# EAGLE schematic RadioNetwork (EAGLE 6.6.0)
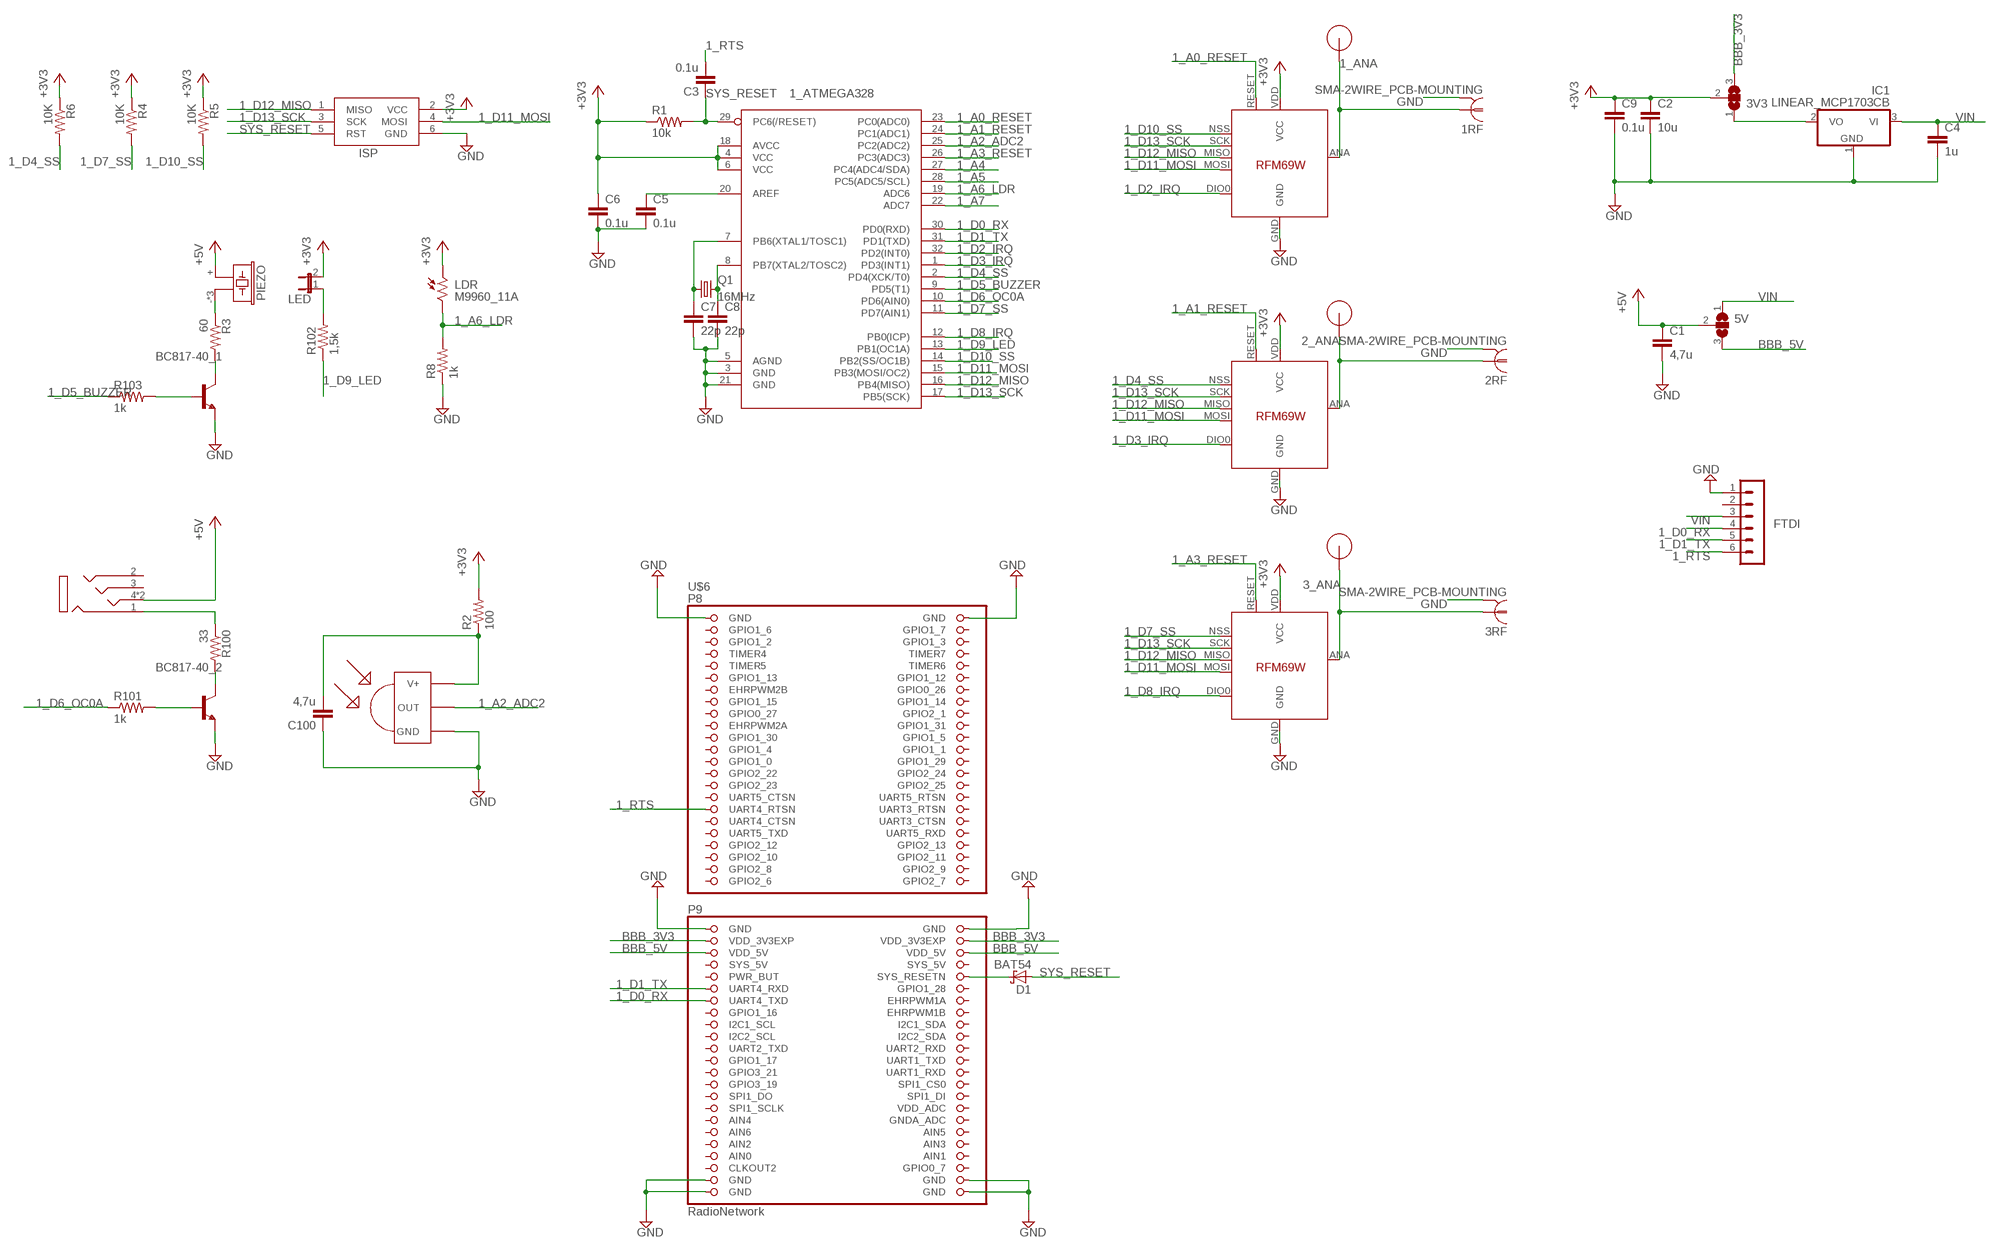
[diagram p0: schematic, sheet 1]

## Parts
1_ATMEGA328  ATMega-328  ATMEGA168/328TQFP32  [TQFP32-08]
1_RFM69  RFM69_MINIPADS  [RFM69W-MINPADS]
1RF  SMA-2WIRE_PCB-MOUNTING  [J01151A0931]
2_RFM69  RFM69_MINIPADS  [RFM69W-MINPADS]
2RF  SMA-2WIRE_PCB-MOUNTING  [J01151A0931]
3_RFM69  RFM69_MINIPADS  [RFM69W-MINPADS]
3RF  SMA-2WIRE_PCB-MOUNTING  [J01151A0931]
3V3  SJ2W  [SJ_2]
5V  SJ2W  [SJ_2]
BC817-40_1  BC817-40-NPN-SOT23-BEC  [SOT23-BEC]
BC817-40_2  BC817-40-NPN-SOT23-BEC  [SOT23-BEC]
C1  4,7u  CAP0603-CAP  [0603-CAP]
C2  10u  CAP0603-CAP  [0603-CAP]
C3  0.1u  CAP0603-CAP  [0603-CAP]
C4  1u  CAP0603-CAP  [0603-CAP]
C5  0.1u  CAP0603-CAP  [0603-CAP]
C6  0.1u  CAP0603-CAP  [0603-CAP]
C7  22p  CAP0603-CAP  [0603-CAP]
C8  22p  CAP0603-CAP  [0603-CAP]
C9  0.1u  CAP0603-CAP  [0603-CAP]
C100  4,7u  CAP0603-CAP  [0603-CAP]
D1  BAT54  [SOT23]
FTDI  FTDI  MA06-1  [MA06-1]
IC1  LINEAR_MCP1703CB  [LINEAR_SOT23]
IR-RX  TSOP4836  [TSOP18XX]
IR-TX  1503_13  [1503-03]
ISP  AVRISP-6  [AVRISP]
LDR  M9960_11A  [M9960]
LED  JP1E  [JP1]
PIEZO  BUZZER-PIEZO_SMD  [BUZZER-PIEZO_SMD]
Q1  16MHz  CRYSTALHC49S  [HC49/S]
R1  10k  RESISTOR0603-RES  [0603-RES]
R2  100  RESISTOR0603-RES  [0603-RES]
R3  60  RESISTOR0603-RES  [0603-RES]
R4  10K  RESISTOR0603-RES  [0603-RES]
R5  10K  RESISTOR0603-RES  [0603-RES]
R6  10K  RESISTOR0603-RES  [0603-RES]
R8  1k  RESISTOR0603-RES  [0603-RES]
R100  33  RESISTOR0603-RES  [0603-RES]
R101  1k  RESISTOR0603-RES  [0603-RES]
R102  1,5k  RESISTOR0603-RES  [0603-RES]
R103  1k  RESISTOR0603-RES  [0603-RES]
U$1  RFM12B_ANTENNA  [RFM12B-ANTENNA]
U$2  RFM12B_ANTENNA  [RFM12B-ANTENNA]
U$5  RFM12B_ANTENNA  [RFM12B-ANTENNA]
U$6  RadioNetwork  BEAGLEBONE_OUTLINE  [BEAGLEBONE_SHIELD]

## Nets
1_A0_RESET: 1_ATMEGA328.23(PC0(ADC0)) 1_RFM69.RESET
1_A1_RESET: 1_ATMEGA328.24(PC1(ADC1)) 2_RFM69.RESET
1_A2_ADC2: 1_ATMEGA328.25(PC2(ADC2)) IR-RX.OUT
1_A3_RESET: 1_ATMEGA328.26(PC3(ADC3)) 3_RFM69.RESET
1_A4: 1_ATMEGA328.27(PC4(ADC4/SDA))
1_A5: 1_ATMEGA328.28(PC5(ADC5/SCL))
1_A6_LDR: 1_ATMEGA328.19(ADC6) LDR.2 R8.2
1_A7: 1_ATMEGA328.22(ADC7)
1_ANA [ANT]: 1_RFM69.ANA(ANT) 1RF.1 U$1.P$1
1_AREF: 1_ATMEGA328.20(AREF) C5.1
1_D0_RX: 1_ATMEGA328.30(PD0(RXD)) FTDI.4 U$6.59(UART4_TXD)
1_D1_TX: 1_ATMEGA328.31(PD1(TXD)) FTDI.5 U$6.57(UART4_RXD)
1_D2_IRQ: 1_ATMEGA328.32(PD2(INT0)) 1_RFM69.DIO0(DIO0/IRQ)
1_D3_IRQ: 1_ATMEGA328.1(PD3(INT1)) 2_RFM69.DIO0(DIO0/IRQ)
1_D4_SS: 1_ATMEGA328.2(PD4(XCK/T0)) 2_RFM69.NSS(SEL) R6.2
1_D5_BUZZER: 1_ATMEGA328.9(PD5(T1)) R103.1
1_D6_OC0A: 1_ATMEGA328.10(PD6(AIN0)) R101.1
1_D7_SS: 1_ATMEGA328.11(PD7(AIN1)) 3_RFM69.NSS(SEL) R4.2
1_D8_IRQ: 1_ATMEGA328.12(PB0(ICP)) 3_RFM69.DIO0(DIO0/IRQ)
1_D9_LED: 1_ATMEGA328.13(PB1(OC1A)) R102.1
1_D10_SS: 1_ATMEGA328.14(PB2(SS/OC1B)) 1_RFM69.NSS(SEL) R5.2
1_D11_MOSI: 1_ATMEGA328.15(PB3(MOSI/OC2)) 1_RFM69.MOSI 2_RFM69.MOSI 3_RFM69.MOSI ISP.4(MOSI)
1_D12_MISO: 1_ATMEGA328.16(PB4(MISO)) 1_RFM69.MISO 2_RFM69.MISO 3_RFM69.MISO ISP.1(MISO)
1_D13_SCK: 1_ATMEGA328.17(PB5(SCK)) 1_RFM69.SCK 2_RFM69.SCK 3_RFM69.SCK ISP.3(SCK)
1_RTS: C3.2 FTDI.6 U$6.33(UART4_RTSN)
2_ANA [ANT]: 2_RFM69.ANA(ANT) 2RF.1 U$5.P$1
3_ANA [ANT]: 3_RFM69.ANA(ANT) 3RF.1 U$2.P$1
+3V3 [power]: 1_ATMEGA328.4(VCC) 1_ATMEGA328.6(VCC) 1_ATMEGA328.18(AVCC) 1_RFM69.VDD(VCC) 2_RFM69.VDD(VCC) 3_RFM69.VDD(VCC) 3V3.2 C2.1 C6.1 C9.1 ISP.2(VCC) LDR.1 LED.2 R1.1 R2.2 R4.1 R5.1 R6.1
+5V [power]: 5V.2 C1.1 IR-TX.4 IR-TX.4-2 PIEZO.+
BBB_3V3 [power]: 3V3.3 U$6.49(VDD_3V3EXP) U$6.50(VDD_3V3EXP)
BBB_5V [power]: 5V.3 U$6.51(VDD_5V) U$6.52(VDD_5V)
GND [power]: 1_ATMEGA328.3(GND) 1_ATMEGA328.5(AGND) 1_ATMEGA328.21(GND) 1_RFM69.GND 1RF.G@1 1RF.G@2 1RF.G@3 1RF.G@4 2_RFM69.GND 2RF.G@1 2RF.G@2 2RF.G@3 2RF.G@4 3_RFM69.GND 3RF.G@1 3RF.G@2 3RF.G@3 3RF.G@4 BC817-40_1.E BC817-40_2.E C1.2 C2.2 C4.2 C5.2 C6.2 C7.2 C8.2 C9.2 C100.1 FTDI.1 IC1.1(GND) IR-RX.GND ISP.6(GND) R8.1 U$6.1(GND) U$6.2(GND) U$6.47(GND) U$6.48(GND) U$6.89(GND) U$6.90(GND) U$6.91(GND) U$6.92(GND)
N$1: 1_ATMEGA328.7(PB6(XTAL1/TOSC1)) C7.1 Q1.1
N$2: PIEZO.- PIEZO.DUMMY PIEZO.DUMMY1 R3.1
N$3: IR-TX.1 R100.1
N$4: BC817-40_2.C R100.2
N$5: D1.3(C) U$6.56(SYS_RESETN)
N$6: 3V3.1 IC1.2(VO)
N$7: 1_ATMEGA328.8(PB7(XTAL2/TOSC2)) C8.1 Q1.2
N$8: BC817-40_1.C R3.2
N$15: BC817-40_1.B R103.2
N$16: C100.2 IR-RX.VCC(V+) R2.1
N$19: BC817-40_2.B R101.2
N$22: LED.1 R102.2
SYS_RESET: 1_ATMEGA328.29(PC6(/RESET)) C3.1 D1.1(A) ISP.5(RST) R1.2
VIN [power]: 5V.1 C4.1 FTDI.3 IC1.3(VI)
Unconnected: FTDI.2 IR-TX.2 IR-TX.3 U$6.3(GPIO1_6) U$6.4(GPIO1_7) U$6.5(GPIO1_2) U$6.6(GPIO1_3) U$6.7(TIMER4) U$6.8(TIMER7) U$6.9(TIMER5) U$6.10(TIMER6) U$6.11(GPIO1_13) U$6.12(GPIO1_12) U$6.13(EHRPWM2B) U$6.14(GPIO0_26) U$6.15(GPIO1_15) U$6.16(GPIO1_14) U$6.17(GPIO0_27) U$6.18(GPIO2_1) U$6.19(EHRPWM2A) U$6.20(GPIO1_31) U$6.21(GPIO1_30) U$6.22(GPIO1_5) U$6.23(GPIO1_4) U$6.24(GPIO1_1) U$6.25(GPIO1_0) U$6.26(GPIO1_29) U$6.27(GPIO2_22) U$6.28(GPIO2_24) U$6.29(GPIO2_23) U$6.30(GPIO2_25) U$6.31(UART5_CTSN) U$6.32(UART5_RTSN) U$6.34(UART3_RTSN) U$6.35(UART4_CTSN) U$6.36(UART3_CTSN) U$6.37(UART5_TXD) U$6.38(UART5_RXD) U$6.39(GPIO2_12) U$6.40(GPIO2_13) U$6.41(GPIO2_10) U$6.42(GPIO2_11) U$6.43(GPIO2_8) U$6.44(GPIO2_9) U$6.45(GPIO2_6) U$6.46(GPIO2_7) U$6.54(SYS_5V) U$6.55(PWR_BUT) U$6.58(GPIO1_28) U$6.60(EHRPWM1A) U$6.61(GPIO1_16) U$6.62(EHRPWM1B) U$6.63(I2C1_SCL) U$6.64(I2C1_SDA) U$6.65(I2C2_SCL) U$6.66(I2C2_SDA) U$6.67(UART2_TXD) U$6.68(UART2_RXD) U$6.69(GPIO1_17) U$6.70(UART1_TXD) U$6.71(GPIO3_21) U$6.72(UART1_RXD) U$6.73(GPIO3_19) U$6.74(SPI1_CS0) U$6.75(SPI1_DO) U$6.76(SPI1_DI) U$6.77(SPI1_SCLK) U$6.78(VDD_ADC) U$6.79(AIN4) U$6.80(GNDA_ADC) U$6.81(AIN6) U$6.82(AIN5) U$6.83(AIN2) U$6.84(AIN3) U$6.86(AIN1) U$6.87(CLKOUT2) U$6.88(GPIO0_7)

## Power pins joined to a net without a drawn wire
AIN0: U$6.85(AIN0)
SYS_5V: U$6.53(SYS_5V)

## Library data of the parts
1_ATMEGA328 = myLib:ATMEGA168/328: Atmel 32-pin 8-bit micro, 16k flash.; BUERKLIN: 64 S 3046
1_RFM69 2_RFM69 3_RFM69 = myLib:RFM69_MINIPADS
1RF 2RF 3RF = myLib:SMA-2WIRE_PCB-MOUNTING: SMA 50 Ohm Straight Jack Receptacle - PCB Mountung www.telegaertner.de Source: Buerklin Artikelnummer: J01151A0931; BUERKLIN: 76F410; EBAY: SMA Female PCB Edge
3V3 5V = jumper:SJ2W: SMD solder JUMPER
BC817-40_1 BC817-40_2 = myLib:*-NPN-: NPN Transistror BF959 corrected 2008.03.06; BUERKLIN: 12S6220
C1 C3 C5 C6 C9 = LowPowerLab:CAP: Capacitor Standard 0603 ceramic capacitor, and 0.1" leaded capacitor.; BUERKLIN: 53 D 1726
C2 = LowPowerLab:CAP: Capacitor Standard 0603 ceramic capacitor, and 0.1" leaded capacitor.; BUERKLIN: 53 D 1652
C4 = LowPowerLab:CAP: Capacitor Standard 0603 ceramic capacitor, and 0.1" leaded capacitor.; BUERKLIN: 53D1660
C7 C8 = LowPowerLab:CAP: Capacitor Standard 0603 ceramic capacitor, and 0.1" leaded capacitor.; BUERKLIN: 53 D 1676
C100 = LowPowerLab:CAP: Capacitor Standard 0603 ceramic capacitor, and 0.1" leaded capacitor.; BUERKLIN: 53 D 1659
D1 = diode:BAT54: Schottky Diodes Source: Fairchild .. BAT54.pdf; BUERKLIN: 10S7581
FTDI = JeeLabs:MA06-1: PIN HEADER; BUERKLIN: 59 F 2134
IC1 = myLib:LINEAR_MCP1703: 250 mA, 16V, Low Quiescent Current LDO Regulator Source: http://ww1.microchip.com/downloads/en/DeviceDoc/22049b.pdf; BUERKLIN: 41 S 7654; CONRAD: 651422-62
IR-RX = myLib:TSOP4836: IR Receiver and Demodulator; CONRAD: 171107-62; EBAY: TSOP34836
IR-TX = myLib:1503_13; BUERKLIN: 39F1215
ISP = myLib:AVRISP: AVR ISP HEADER Standard 6 pin header for AVR programming; BUERKLIN: 56F6228; CONRAD: 737480 - 62
LDR = photo-elements:M9960_11: Photo Sensor Beacon Light, Photometer Applications Source: http://optoelectronics.perkinelmer.com/content/Datasheets/DTS_M9960.pdf; CONRAD: 145483 - 62
LED = jumper:JP1E: JUMPER
PIEZO = myLib:BUZZER-PIEZO_SMD: Piezoelectric Acoustic Transducer; BUERKLIN: 36 M 370
Q1 = crystal:CRYSTAL: CRYSTAL; BUERKLIN: 78D428; OC_FARNELL: 1667008; OC_NEWARK: unknown
R1 R4-R6 = LowPowerLab:RESISTOR: Resistor Basic schematic elements and footprints for 0603, 1206, and PTH resistors.; BUERKLIN: 26 E 816
R2 = LowPowerLab:RESISTOR: Resistor Basic schematic elements and footprints for 0603, 1206, and PTH resistors.; BUERKLIN: 26 E 768
R3 = LowPowerLab:RESISTOR: Resistor Basic schematic elements and footprints for 0603, 1206, and PTH resistors.; BUERKLIN: 26E7031
R8 R101 R103 = LowPowerLab:RESISTOR: Resistor Basic schematic elements and footprints for 0603, 1206, and PTH resistors.; BUERKLIN: 26 E 792
R100 = LowPowerLab:RESISTOR: Resistor Basic schematic elements and footprints for 0603, 1206, and PTH resistors.; BUERKLIN: 26 E 756
R102 = LowPowerLab:RESISTOR: Resistor Basic schematic elements and footprints for 0603, 1206, and PTH resistors.; BUERKLIN: 26 E 778
U$1 U$2 U$5 = LowPowerLab:RFM12B_ANTENNA
U$6 = myLib:BEAGLEBONE_OUTLINE: Should match A3 pinout - but not completely tested; CONRAD: 393509 - 62

## Net classes
1 power: width 0.381 mm, clearance 0.254 mm
2 ANT: width 0.381 mm, clearance 0.254 mm